# EAGLE design sirvo.v2.6 (EAGLE 6.4)
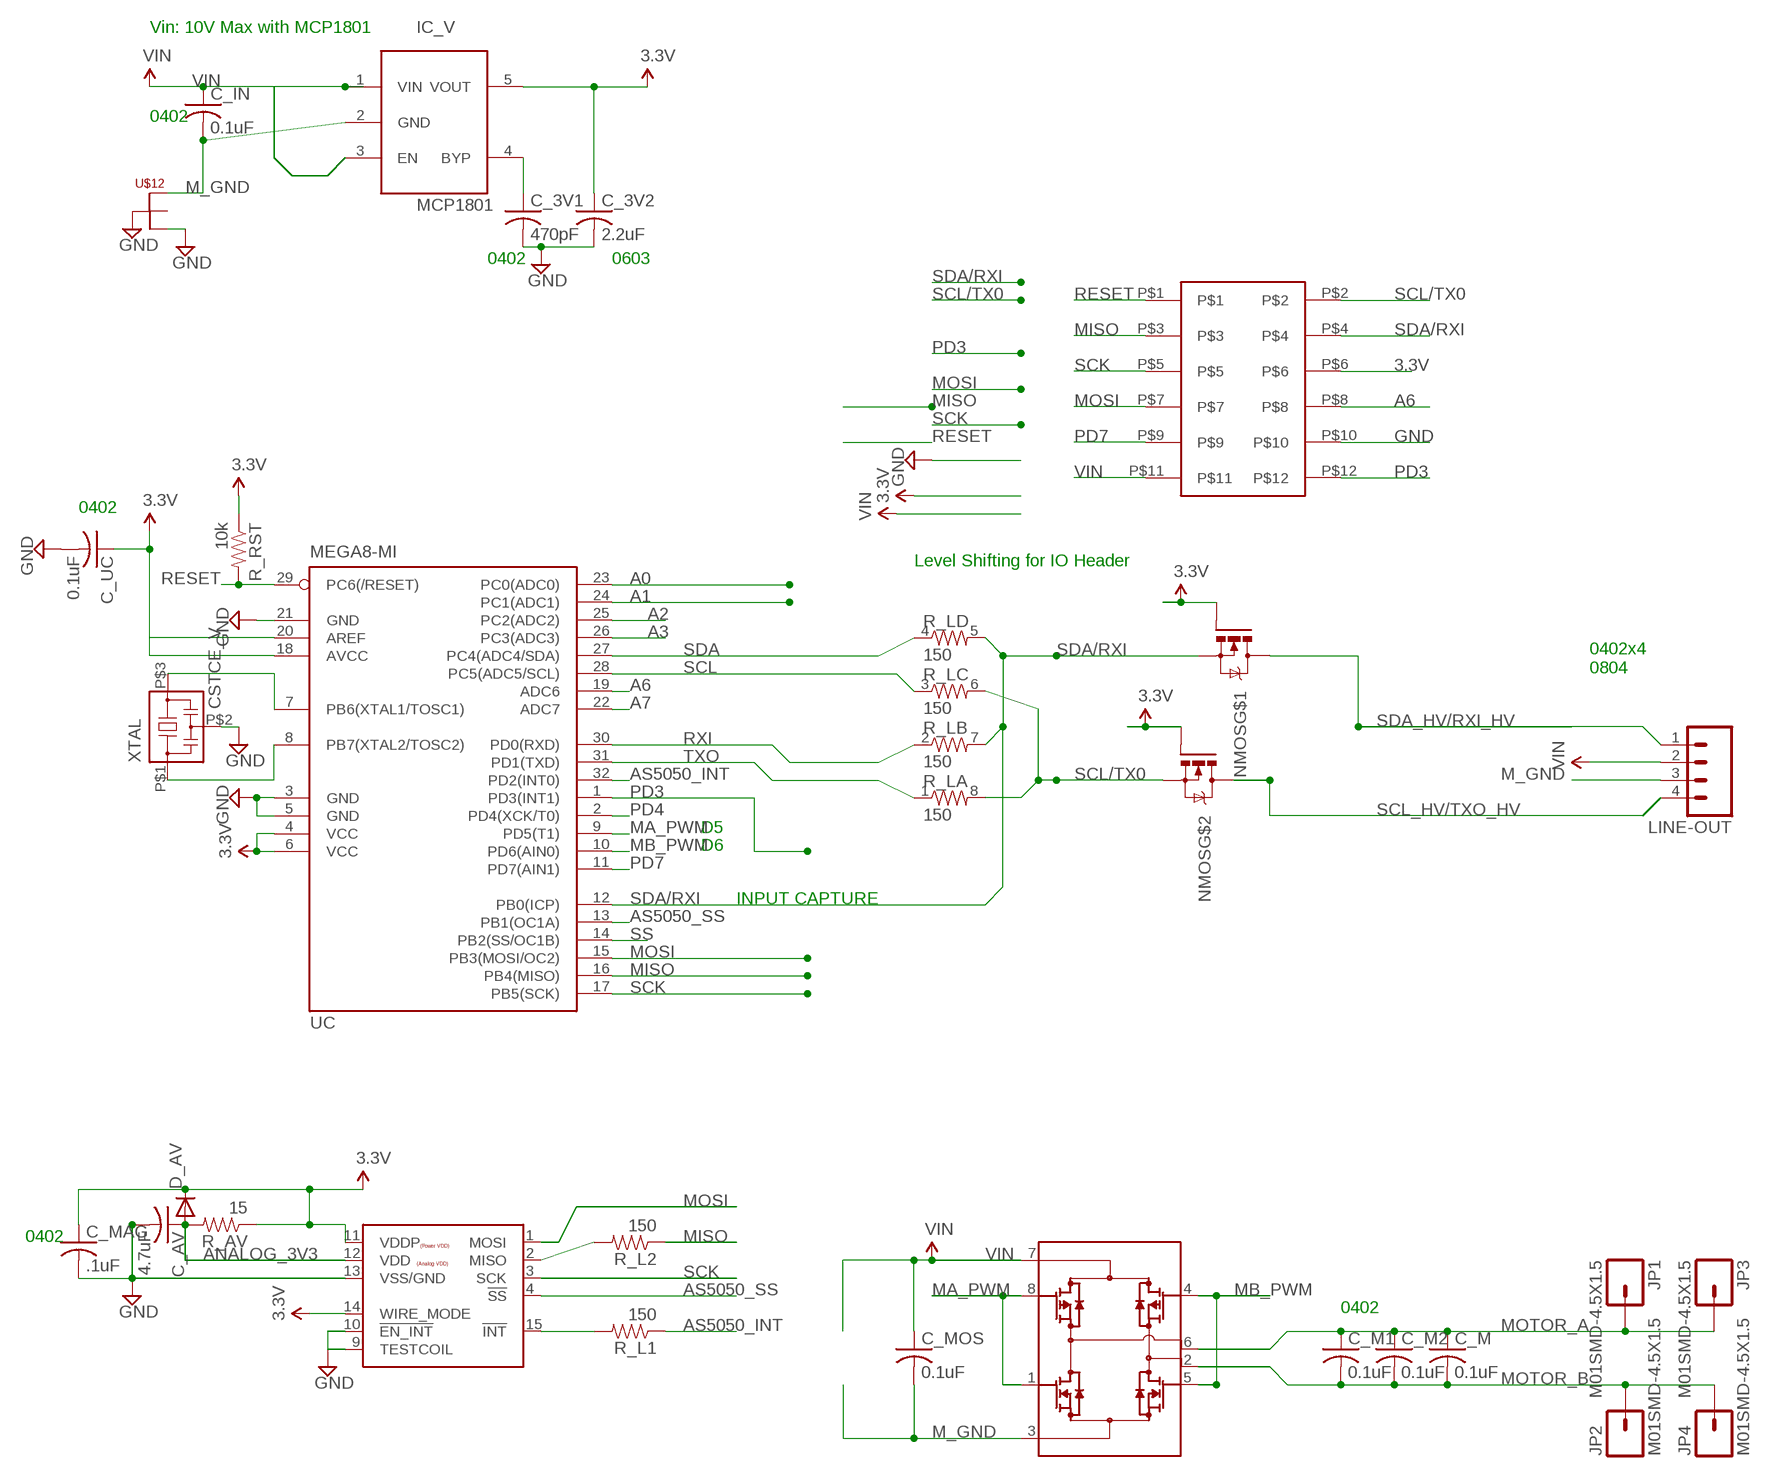
[diagram p0: schematic, sheet 1]

## Parts
<HEADER>  M06X022MM_SMT  [M2X06_SMD]
C_3V1  470pF  C-USC0402  [C0402]
C_3V2  2.2uF  C-USC0603  [C0603]
C_AV  4.7uF  C-USC0603  [C0603]
C_IN  0.1uF  C-USC0402  [C0402]
C_M  0.1uF  C-USC0402  [C0402]
C_M1  0.1uF  C-USC0402  [C0402]
C_M2  0.1uF  C-USC0402  [C0402]
C_MAG  .1uF  C-USC0402  [C0402]
C_MOS  0.1uF  C-USC0402  [C0402]
C_UC  0.1uF  C-USC0402  [C0402]
D_AV  DIODESOD  [SOD-323]
IC_V  MCP1801  LDO-REGULATORMCP1801  [SOT23-5L]
JP1  M01SMD-4.5X1.5  [PAD-1.5X4.5]
JP2  M01SMD-4.5X1.5  [PAD-1.5X4.5]
JP3  M01SMD-4.5X1.5  [PAD-1.5X4.5]
JP4  M01SMD-4.5X1.5  [PAD-1.5X4.5]
LINE-OUT  M041X04_NO_SILK  [1X04_NO_SILK]
MAG  AS5050  [QFN16_4X4]
MOS  MOSFET-ARRAYMOSFET-ARRAY-H-BRIDGE  [SO08]
NMOS  MOSFET-ARRAY-PAIR  [SOT-363]
R_AV  15  RESISTOR0603-RES  [0603-RES]
R_L  150  RESISTOR-ARRAY0603-ARV  [0603-ARV]
R_L1  150  RESISTOR0402-RES  [0402-RES]
R_L2  150  RESISTOR0402-RES  [0402-RES]
R_RST  10k  RESISTOR0603-RES  [0603-RES]
U$12  NET-JUNCTION8-MIL-DIAMETER  [NET-JUNCTION]
UC  MEGA8-MI  [MLF32]
XTAL  CSTCE_V  [CSTCE_V]

## Nets
3.3V: <HEADER>.P$6 C_3V2.1 C_MAG.1 C_UC.1 D_AV.1(C) IC_V.5(VOUT) MAG.11(VDDP) MAG.14(WIRE_MODE) NMOS.P$2(G) NMOS.P$5(G) R_AV.1 R_RST.1 UC.4(VCC) UC.6(VCC) UC.20(AREF)
A0: UC.23(PC0(ADC0))
A1: UC.24(PC1(ADC1))
A2: UC.25(PC2(ADC2))
A3: UC.26(PC3(ADC3))
A6: <HEADER>.P$8 UC.19(ADC6)
A7: UC.22(ADC7)
ANALOG_3V3: C_AV.1 D_AV.2(A) MAG.12(VDD) R_AV.2
AS5050_INT: R_L1.1 UC.32(PD2(INT0))
AS5050_SS: MAG.4(!SS) UC.13(PB1(OC1A))
GND: <HEADER>.P$10 C_3V1.2 C_3V2.2 C_AV.2 C_MAG.2 C_UC.2 MAG.9(TESTCOIL) MAG.10(!EN_INT) MAG.13(VSS/GND) U$12.P$1 U$12.P$4 UC.3(GND) UC.5(GND) UC.21(GND) XTAL.P$2
M_GND: C_IN.2 C_MOS.2 IC_V.2(GND) LINE-OUT.3 MOS.3(N1S/N2S) U$12.P$3
MA_PWM: MOS.1(N1G) MOS.8(P1G) UC.9(PD5(T1))
MB_PWM: MOS.4(N2G) MOS.5(P2G) UC.10(PD6(AIN0))
MISO: <HEADER>.P$3 R_L2.1 UC.16(PB4(MISO))
MOSI: <HEADER>.P$7 MAG.1(MOSI) UC.15(PB3(MOSI/OC2))
MOTOR_A: C_M1.1 C_M2.1 C_M.1 JP1.P$1 JP3.P$1 MOS.6(N2D/P2D)
MOTOR_B: C_M1.2 C_M2.2 C_M.2 JP2.P$1 JP4.P$1 MOS.2(N1D/P1D)
N$1: UC.7(PB6(XTAL1/TOSC1)) XTAL.P$3
N$2: UC.8(PB7(XTAL2/TOSC2)) XTAL.P$1
N$4: C_3V1.1 IC_V.4(BYP)
N$6: MAG.15(!INT) R_L1.2
N$14: MAG.2(MISO) R_L2.2
N$15: UC.18(AVCC)
PD3: <HEADER>.P$12 UC.1(PD3(INT1))
PD4: UC.2(PD4(XCK/T0))
PD7: <HEADER>.P$9 UC.11(PD7(AIN1))
RESET: <HEADER>.P$1 R_RST.2 UC.29(PC6(/RESET))
RXI: R_L.2 UC.30(PD0(RXD))
SCK: <HEADER>.P$5 MAG.3(SCK) UC.17(PB5(SCK))
SCL: R_L.3 UC.28(PC5(ADC5/SCL))
SCL/TX0: <HEADER>.P$2 NMOS.P$1(S) R_L.6 R_L.8
SCL_HV/TXO_HV: LINE-OUT.4 NMOS.P$6(D)
SDA: R_L.4 UC.27(PC4(ADC4/SDA))
SDA/RXI: <HEADER>.P$4 NMOS.P$4(S) R_L.5 R_L.7 UC.12(PB0(ICP))
SDA_HV/RXI_HV: LINE-OUT.1 NMOS.P$3(D)
SS: UC.14(PB2(SS/OC1B))
TXO: R_L.1 UC.31(PD1(TXD))
VIN: <HEADER>.P$11 C_IN.1 C_MOS.1 IC_V.1(VIN) IC_V.3(EN) LINE-OUT.2 MOS.7(P1S/P2S)
Unconnected: U$12.P$5

## Notes on the sheet
- Vin: 10V Max with MCP1801
- 0402
- 0402 | 0603
- 0402
- Level Shifting for IO Header
- 0402x4
  0804
- D5
- D6
- INPUT CAPTURE
- 0402
- 0402

## Library data of the parts
<HEADER> = tekdemo:M06X02
C_3V1 C_3V2 C_AV C_IN C_M C_M1 C_M2 C_MAG C_MOS C_UC = rcl:C-US: CAPACITOR, American symbol
D_AV = tekdemo:DIODE: Diode These are standard reverse protection diodes and small signal diodes. SMA package can handle up to about 1A. SOD-323 can handle about 200mA. What the SOD-323 package when ordering, there are some mfgs out there that are 5-pin packages.
IC_V = tekdemo:LDO-REGULATOR: Standard LDO Footprint
JP1-JP4 = SparkFun-Connectors:M01: Header 1 Standard 1-pin 0.1" header. Use with straight break away headers (SKU : PRT-00116), right angle break away headers (PRT-00553), swiss pins (PRT-00743), machine pins (PRT-00117), and female headers (PRT-00115).
LINE-OUT = SparkFun-Connectors:M04: Header 4 Standard 4-pin 0.1" header. Use with straight break away headers (SKU : PRT-00116), right angle break away headers (PRT-00553), swiss pins (PRT-00743), machine pins (PRT-00117), and female headers (PRT-00115). Molex polarized connector foot print use with SKU : PRT-08231 with associated crimp pins and housings. 1MM SMD Version SKU: PRT-10208
MAG = tekdemo:AS5050
MOS = tekdemo:MOSFET-ARRAY
NMOS = tekdemo:MOSFET-ARRAY-PAIR
R_AV R_L1 R_L2 R_RST = SparkFun-Passives:RESISTOR: Resistor Basic schematic elements and footprints for 0603, 1206, and PTH resistors.
R_L = SparkFun-Passives:RESISTOR-ARRAY: Array Chip Resistor Source: RS Component / Phycomp
U$12 = tekdemo:NET-JUNCTION
UC = atmel:MEGA8: MICROCONTROLLER 8 Kbytes FLASH, 1 kbytes SRAM, 512 bytes EEPROM, USART, 6-channel 10 bit ADC, 2-channel 8 bit ADC Pin compatible with Atmega48, ATMega88, ATMega168 Source: avr.lbr; MPN: ATMEGA88PA-MU; OC_FARNELL: 1715491; OC_NEWARK: 15R0272
XTAL = tekdemo:CSTCE_V

## Board
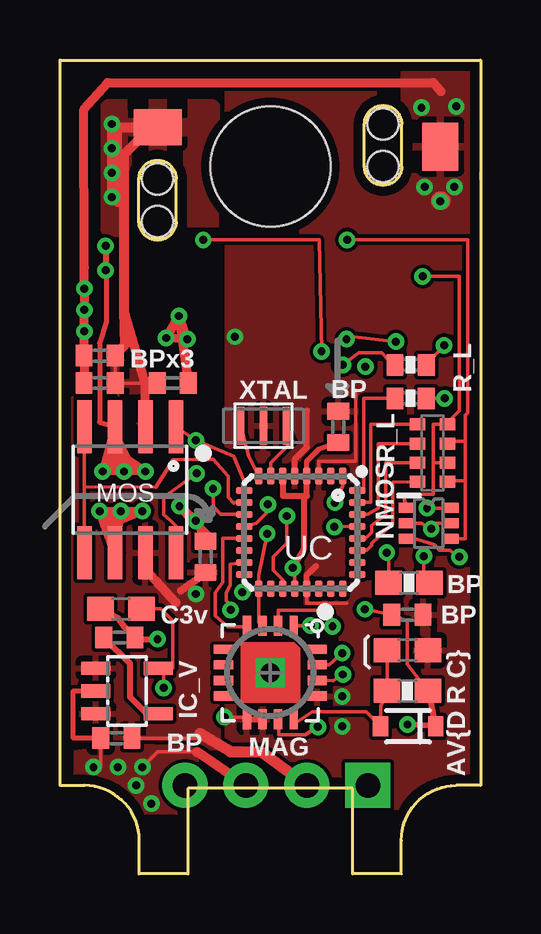
[diagram p1: board, top side]
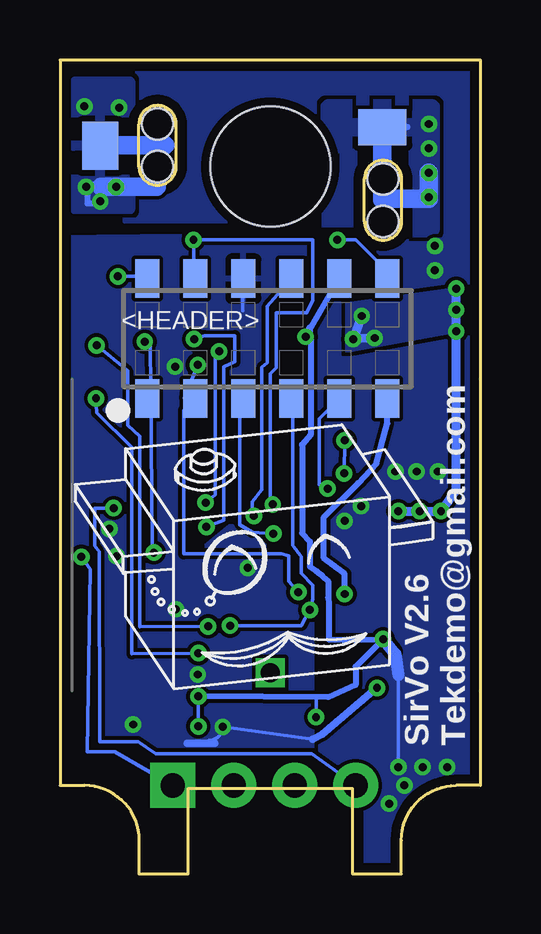
[diagram p2: board, bottom side, seen from below]

Size 17.53 x 33.91 mm. Coordinates in mm from the lower left corner, seen from the top.
Copper layers (1*16): Top 0.0356mm / dielectric 1.5011mm / Bottom 0.0356mm
Design rules "LaenPCBOrder *": minimum track width 6mil, minimum drill 13mil, track to track 6mil, track to pad 6mil, pad to pad 6mil, via to via 6mil, smd to smd 6mil, copper to edge 15mil, drill to drill 6mil, minimum pad ring 7mil, minimum via ring 7mil, stop-mask expansion 4mil, vias tented up to drill 0mil, thermal gap 10mil
tKeepout: area 0,20.3 to 17.5,33.9

### Footprints (pad centres in the part's own frame; a part is rotated, then mirrored left to right if it is on the bottom)
M2X06_SMD = smd 1 x 1.6: P$1 -5,-2.5; P$2 -5,2.5; P$3 -3,-2.5; P$4 -3,2.5; P$5 -1,-2.5; P$6 -1,2.5; P$7 1,-2.5; P$8 1,2.5; P$9 3,-2.5; P$10 3,2.5; P$11 5,-2.5; P$12 5,2.5
C0402 = smd 0.7 x 0.9: 1 -0.65,0; 2 0.65,0
C0603 = smd 1.1 x 1: 1 -0.85,0; 2 0.85,0
SOD-323 = smd 0.63 x 0.83: 1 -1.15,0; 2 1.15,0
SOT23-5L = smd 0.55 x 1.2: 1 -0.95,-1.3; 2 0,-1.3; 3 0.95,-1.3; 4 0.95,1.3; 5 -0.95,1.3
PAD-1.5X4.5 = smd 1.5 x 2: P$1 0,0
1X04_NO_SILK = drill 1.016 pad 1.88 square: 1 0,0 | drill 1.016 pad 1.88: 2 2.54,0; 3 5.08,0; 4 7.62,0
QFN16_4X4 = smd 0.8 x 0.35: 1 -1.95,0.975; 2 -1.95,0.325; 3 -1.95,-0.325; 4 -1.95,-0.975; 9 1.95,-0.975; 10 1.95,-0.325; 11 1.95,0.325; 12 1.95,0.975 | smd 0.35 x 0.8: 5 -0.975,-1.95; 6 -0.325,-1.95; 7 0.325,-1.95; 8 0.975,-1.95; 13 0.975,1.95; 14 0.325,1.95; 15 -0.325,1.95; 16 -0.975,1.95 | drill 0.8 square: P$1 0,0
SO08 = smd 0.61 x 2.21: 1 -1.905,-2.616; 2 -0.635,-2.616; 3 0.635,-2.616; 4 1.905,-2.616; 5 1.905,2.616; 6 0.635,2.616; 7 -0.635,2.616; 8 -1.905,2.616
SOT-363 = smd 0.42 x 0.6: P$1 -0.65,-0.95; P$2 0,-0.95; P$3 0.65,-0.95; P$4 0.65,0.95; P$5 0,0.95; P$6 -0.65,0.95
0603-RES = smd 1.1 x 1: 1 -0.85,0; 2 0.85,0
0603-ARV = smd 0.5 x 0.65: 1 -1.2,-0.625; 2 -0.4,-0.625; 3 0.4,-0.625; 4 1.2,-0.625; 5 1.2,0.625; 6 0.4,0.625; 7 -0.4,0.625; 8 -1.2,0.625
0402-RES = smd 0.7 x 0.9: 1 -0.65,0; 2 0.65,0
SERVO-OUTLINE = hole 5: 8.763,29.464 | hole 1.3: 4.064,27.178; 4.064,28.956; 13.462,29.464; 13.462,31.242
NET-JUNCTION = smd 0.051 x 0.051: P$1 -0.076,0; P$3 0,0.076; P$4 0.076,0; P$5 0,-0.076
MLF32 = smd 0.7 x 0.3: 1 -2.35,1.75; 2 -2.35,1.25; 3 -2.35,0.75; 4 -2.35,0.25; 5 -2.35,-0.25; 6 -2.35,-0.75; 7 -2.35,-1.25; 8 -2.35,-1.75; 17 2.35,-1.75; 18 2.35,-1.25; 19 2.35,-0.75; 20 2.35,-0.25; 21 2.35,0.25; 22 2.35,0.75; 23 2.35,1.25; 24 2.35,1.75 | smd 0.3 x 0.7: 9 -1.75,-2.35; 10 -1.25,-2.35; 11 -0.75,-2.35; 12 -0.25,-2.35; 13 0.25,-2.35; 14 0.75,-2.35; 15 1.25,-2.35; 16 1.75,-2.35; 25 1.75,2.35; 26 1.25,2.35; 27 0.75,2.35; 28 0.25,2.35; 29 -0.25,2.35; 30 -0.75,2.35; 31 -1.25,2.35; 32 -1.75,2.35
CSTCE_V = smd 0.3 x 1.6: P$1 -0.95,0; P$2 0,0; P$3 0.95,0

### Placement (x,y rotation side)
<HEADER>  8.89,22.3 0 bottom
C_3V1  2.48,9.84 0 top
C_3V2  2.54,11.05 180 top
C_AV  14.48,9.32 0 top
C_IN  2.35,5.65 180 top
C_M  1.65,20.45 0 top
C_M1  4.7,20.45 180 top
C_M2  1.65,21.59 0 top
C_MAG  14.48,10.79 0 top
C_MOS  6.07,13.21 90 top
C_UC  11.6,18.62 90 top
D_AV  14.5,6.15 180 top
IC_V  2.79,7.62 270 top
JP1  15.85,30.3 0 top
JP2  4.06,31.11 90 top
JP3  15.85,30.33 0 bottom
JP4  4.09,31.11 270 bottom
LINE-OUT  12.83,3.68 180 top
MAG  8.76,8.38 270 top
MOS  2.92,16 180 top
NMOS  15.37,14.61 270 top
R_AV  14.48,7.62 180 top
R_L  15.52,17.53 270 top
R_L1  14.61,19.81 0 top
R_L2  14.61,21.21 0 top
R_RST  14.54,12.13 180 top
U$1  [LOGO-SIRVO-GOLD]  17.02,7.62 0 bottom
U$3  [SERVO-OUTLINE]  0,0 0 top
U$12  3.63,9.17 270 bottom
UC  10.03,14.22 270 top
XTAL  8.48,18.67 0 top

### Tracks (layer width: path | path; a pad name or v marks a point on that pad's centre or on a via)
3.3V  (via drill 0.33 pad 0.18)
  Top 0.152: v9.7,12.75 9.78,12.47 9.78,11.74 UC.20 | v12.7,11.02 C_MAG.1 14.48,10.53 14.48,8.72 R_AV.1 | v4.32,7.75 4.32,8.57 IC_V.5 4.7,8.57 4.7,10.54 4.19,11.05 C_3V2.1 | 10.29,16.45 UC.4 | NMOS.P$5 15.67,14.61 v15.47,14.38 15.06,14.61 NMOS.P$2 | MAG.11 9.11,5.79 10.21,5.79 v10.74,6.12 | MAG.14 10.98,8.06 11.38,8.05 v11.79,8.31 | R_RST.1 arc-90 15.16,12.61 v15.16,13.23 | 14.43,6.22 v14.48,6.22 | 11.66,18 11.65,18 C_UC.1
  Top 0.203: UC.4 10.28,17.19 10.79,17.7 11.66,18
  Top 0.254: R_AV.1 15.32,7.87 D_AV.1 14.43,6.22 | UC.6 9.28,15.75 10.16,15.75 | 10.16,15.75 10.29,15.75 10.29,16.45 | 10.16,15.75 10.16,13.54 v9.7,12.75
  Bottom 0.152: 6.99,5.61 v10.74,6.12 arc90 11.3,5.56 | <HEADER>.P$6 9.91,24.79 9.91,23.47
  Bottom 0.305: v4.32,7.75 6.6,5.82 6.99,5.61 | 12.22,5.44 11.07,5.44
  other vias: 12.73,21.13
  pour Bottom (rank 2): 6.99,0 6.99,26.67 17.78,26.54 17.53,23.11 17.4,0
A6  (via drill 0.33 pad 0.18)
  Top 0.152: UC.19 9.28,12.26 8.89,12.65 8.89,13.21 9.45,13.77 v9.45,14.91
  Bottom 0.152: v9.45,14.91 9.53,15.04 9.53,15.49 9.12,16 9.12,21.11 8.89,21.29 8.89,23.65 <HEADER>.P$8
ANALOG_3V3
  Top 0.152: C_AV.1 R_AV.2 13.37,6.99 D_AV.2 12.75,6.76 10.52,6.76 9.74,6.22 MAG.12
  Top 0.254: C_AV.1 13.33,9.36
AS5050_INT
  Top 0.152: R_L1.1 12.65,19.81 12.65,15.97 UC.32
AS5050_SS
  Top 0.152: UC.13 6.78,13.97 6.78,12.14 6.48,11.71 6.48,10.74 6.99,10.29 7.79,10.29 MAG.4
GND  (via drill 0.33 pad 0.18)
  Top 0.152: UC.3 10.78,17.2 12.32,17.2 12.32,20.07 | C_3V1.2 arc90 3.19,9.78 | v6.86,6.53 7.79,6.53 MAG.9 | 11.94,11.28 10.28,11.28 UC.21 10.29,11.94
  Top 0.254: MAG.9 MAG.10 | 10.78,16.8 UC.3 | 9.78,17.14 UC.5 9.78,17.28 10.29,17.78 10.29,19.3 | C_3V1.2 2.67,10.29 2.41,10.67 C_3V2.2 | 3.19,9.78 v4.06,9.78 | 10.29,11.94 10.29,12.45 10.67,12.83
  Bottom 0.152: v11.76,7.39 v11.76,6.15 | 6.35,7.37 6.86,7.37 v6.86,6.53
  Bottom 0.254: v11.76,7.39 6.35,7.37 5.21,7.87 5.21,8.64 v4.06,9.78 6.32,9.75 6.32,11.25 6.35,11.51 6.35,12.19 arc-12 7.11,12.8 7.11,13.84 arc-45 7.12,13.85 7.44,14.2 7.44,17.85 arc45 7.44,17.89 7.09,18.29 7.09,22.17 7.14,22.76 v7.29,22.38 <HEADER>.P$10 | U$12.P$4 U$12.P$1
  Bottom 0.508: U$12.P$1 v4.06,9.78
  pour Top: 6.99,2.29 6.99,36.2 17.4,34.16 18.42,1.52
M_GND  (via drill 0.33 pad 0.18)
  Top 0.152: 5.71,5.08 4.06,5.08 v3.43,4.45 | C_IN.2 1.7,4.45 v1.4,4.45
  Top 0.203: C_IN.2 0.56,5.65 0.56,7.62 IC_V.2 | 1.93,25.15 1.93,23.01 1.65,22.12 1.65,18.82 MOS.3
  Top 0.254: v1.91,26.16 v1.91,25.15 1.93,25.15
  Top 0.305: C_MOS.2 v5.66,14.71 | MOS.3 v1.78,16.76 v2.67,16.76 v3.56,16.76
  Top 0.381: v2.67,16.76 2.29,18.29 | v3.56,16.76 2.79,17.27 2.29,18.29 | 2.29,18.29 2.16,16.89 | v5.66,14.71 v4.98,15.32 6.12,14.12
  Top 0.406: LINE-OUT.3 5.71,5.08
  Bottom 0.152: 3.43,8.28 v3.43,4.45
  Bottom 0.508: U$12.P$3 3.43,8.28
  other vias: 2.41,4.45 3.18,3.68 3.81,2.92
  pour Bottom (rank 4): -0.38,0.51 6.99,0 6.99,27.05 -0.38,27.18
  pour Top: 0.64,5.08 2.49,5.36 5.38,5.31 5.71,5.08 5.71,2.54 0.64,2.54
  pour Bottom (rank 6): -1.14,34.04 14.86,33.78 14.86,27.18 6.99,27.18 6.99,24.64 -0.38,24.64 -1.14,25.4
MA_PWM  (via drill 0.33 pad 0.18)
  Top 0.152: MOS.8 4.83,14.5 4.6,14.73 arc45 4.59,14.73 4.32,14.96 4.32,15.7 v5.69,16.69 | UC.9 7.7,16.29 7.24,17.4 v5.66,18.06 MOS.1
  Bottom 0.152: v5.69,16.69 v5.66,18.06
MB_PWM
  Top 0.152: MOS.4 1.02,16.13 | 1.02,16.13 MOS.5 | UC.10 7.26,15.47 7.25,15.45 arc-45 7.24,15.45 7.01,15.7 7.01,16.56 6.38,17.27 5.71,17.27 4.72,17.25 3.99,16.1 1.02,16.13
MISO  (via drill 0.33 pad 0.18)
  Top 0.152: UC.16 v7.6,11.74 | R_L2.1 13.87,21.21 13.41,21.72 12.45,21.72 v11.79,21.21
  Bottom 0.152: v7.6,11.74 8,12.19 8,13.26 8.31,13.34 12.37,13.34 12.37,19.32 <HEADER>.P$3 11.9,19.82 12.34,19.82 v11.79,21.21
MOSI  (via drill 0.33 pad 0.18)
  Top 0.152: UC.15 7.09,12.9 7.09,12.04 6.93,11.68 6.93,11.38 7.11,11.15 arc-45 7.11,11.14 v7.11,11 | MAG.1 v10.44,10.34
  Bottom 0.152: v10.44,10.34 7.47,10.34 v7.11,11 6.99,11.43 6.99,12.01 7.47,12.52 7.47,13.21 7.82,13.69 7.82,19.73 <HEADER>.P$7
MOTOR_A  (via drill 0.33 pad 0.18)
  Top 0.152: MOS.6 2.54,13.39
  Top 0.254: C_M1.1 5.32,20.47 5.32,20.58
  Top 0.381: MOS.6 v1.65,15.11 v2.54,15.11 | v2.54,15.11 v3.43,15.11 1.91,14.48 2.16,14.99 | 2.29,13.46 v2.54,15.11 | v1.02,24.38 1.02,25.27 0.99,31.85 1.98,32.97 15.54,32.97 15.88,32.59 | 1,24.37 v1.02,24.38 | 1.02,21.59 v1.02,22.61 v1.02,23.5 v1.02,24.38 | C_M2.1 1.02,21.59 | 1.02,21.59 1.02,20.45 C_M.1 | v4.95,23.24 5.32,20.58 5.33,20.45 | v4.95,23.24 v5.31,22.28 v4.42,22.33 v4.95,23.24
  Top 0.762: 15.85,28.04 15.88,28.04
  Bottom 0.254: 15.88,30.35 15.88,30.38 | 15.88,28.7 16.38,28.7 16.38,27.94 15.88,27.94
  Bottom 0.381: v3.43,15.11 v1.65,15.11 1.02,16 v1.02,24.38 | v4.42,22.33 v5.31,22.28 v4.95,23.24
  Bottom 0.762: 15.88,30.35 13.49,30.35 | 13.49,30.35 13.13,30.35 | 13.49,30.35 13.49,28.63 15.8,28.63
  other vias: 15.06,31.93 15.19,28.63 15.85,28.02 16.43,28.63 16.51,31.98
  pour Bottom: 1.04,24.38 arc90 1.02,24.36 1.02,22.61 5.59,21.77 5.59,23.75
  pour Bottom (rank 2): 14.61,33.02 14.61,27.69 16.89,27.69 16.89,33.02
  pour Top: 14.35,33.53 14.35,27.18 17.4,27.18 17.4,33.53
MOTOR_B  (via drill 0.33 pad 0.18)
  Top 0.152: C_M1.2 3.56,20.45 C_M.2 C_M2.2
  Top 0.381: 2.67,23.44 3.56,20.45 MOS.2 | 3.81,31.11 JP2.P$1
  Top 0.406: 3.81,31.11 2.67,29.97 2.67,23.44 2.72,22.05 2.29,21.62 | v2.16,31.24 v2.16,30.23 v2.16,29.21 v2.16,28.19 | 2.39,27.99 2.39,31.11 JP2.P$1
  Top 0.457: JP2.P$1 JP4.P$1
  Bottom 0.254: 3.05,31.11 4.06,30.56 JP4.P$1 | v2.16,29.21 2.16,29.23
  Bottom 0.762: v2.16,29.21 v2.16,28.19 | 2.16,28.12 4.09,28.12
  pour Top: 3.56,18.54 3.68,20.45 2.03,21.72 1.65,20.45 2.29,20.45
  pour Bottom (rank 2): 2.08,31.88 2.08,26.9 6.3,26.9 6.3,31.9 2.08,31.9 arc90 2.06,31.88
  pour Top: 2.08,31.88 2.08,26.9 6.3,26.9 6.3,31.9 2.08,31.9 arc90 2.06,31.88
  pour Top: 2.08,31.88 2.08,26.9 6.3,26.9 6.3,31.9 2.08,31.9 arc90 2.06,31.88
N$1
  Top 0.152: UC.7 8.78,17.12 9.68,18.02 XTAL.P$3
N$2
  Top 0.152: UC.8 7.87,17.4 XTAL.P$1
N$3
  pour Bottom: 8.89,14.1 8.89,13.34 11.81,13.34 10.41,14.48
N$4
  Top 0.152: IC_V.4 3.62,6.67
  Top 0.254: 3.62,6.67 2.92,7.37 2.92,8.75 C_3V1.1
N$6  (via drill 0.33 pad 0.18)
  Top 0.152: R_L1.2 v16.03,19.81 | MAG.15 11.22,8.71 v11.76,9.2
  Bottom 0.152: v16.03,19.81 16,19.2 14.53,17.78 14.53,9.17 v11.76,9.2
N$7
  Bottom 0.762: 4.09,28.09 4.09,31.09
N$12
  Top 0.381: 2.29,18.03 2.41,16.89
N$14  (via drill 0.33 pad 0.18)
  Top 0.152: R_L2.2 v16,22.02 | MAG.2 9.09,10.97 11.25,10.97 v11.35,10.31
  Bottom 0.152: v16,22.02 14.71,20.96 14.71,18.69 14.2,18.24 14.2,10.29 v11.35,10.31
PD3  (via drill 0.33 pad 0.18)
  Top 0.152: 11.79,16.59 11.79,16.18 | 11.79,16.18 v11.46,15.47 | v10.9,21.77 10.79,26.42 v5.97,26.42 | UC.1 11.78,16.18 11.79,16.18
  Bottom 0.152: v11.46,15.47 11.05,15.8 11.05,21.59 v10.9,21.77 | v5.97,26.42 5.21,26.42 3.94,25.15 3.94,24.85 <HEADER>.P$12
PD7  (via drill 0.33 pad 0.18)
  Top 0.152: UC.11 arc90 7.67,14.99 6.71,14.99 6.38,15.31 arc-45 6.38,15.32 v6.38,16.05
  Bottom 0.152: v6.38,16.05 6.73,16.2 arc45 6.73,16.21 6.73,18.96 arc45 6.73,18.96 <HEADER>.P$9
RESET  (via drill 0.33 pad 0.18)
  Top 0.152: R_RST.2 13.69,13.23 v13.61,13.39 | v14,22.17 11.89,22.43 v11.94,22.28 | v11.43,14.45 UC.29
  Bottom 0.152: v13.61,13.39 13.69,13.67 13.75,20.07 13.77,22.2 v14,22.17 | v11.94,22.28 11.51,22.43 10.24,22.43 10.24,21.34 10.69,21.13 10.69,14.73 v11.43,14.45
  Bottom 0.254: <HEADER>.P$1 13.89,19.92 13.75,20.07
RXI
  Top 0.152: UC.30 12.82,14.97 12.83,14.99 13.26,15.23 13.26,17.93 R_L.2
SCK  (via drill 0.33 pad 0.18)
  Top 0.152: MAG.3 8.28,10.49 UC.17 8.28,12.45 v8.64,14.17
  Bottom 0.152: v8.64,14.17 9.53,14.22 10.03,14.55 10.03,19.66 <HEADER>.P$5
SCL
  Top 0.152: R_L.3 13.56,17.13 13.56,14.96 12.98,14.53 12.98,14.23 12.72,13.97 UC.28
SCL/TX0  (via drill 0.33 pad 0.18)
  Top 0.152: NMOS.P$1 14.3,15.82 15.54,15.82 15.54,17.13 | 15.54,17.13 15.54,18.73 R_L.8 16.15,18.75 16.15,18.82 16.64,19.3 16.64,24.89 v15.11,24.89 | 15.54,17.13 R_L.6
  Bottom 0.152: v15.11,24.89 13.89,24.89 <HEADER>.P$2
SCL_HV/TXO_HV  (via drill 0.33 pad 0.18)
  Top 0.152: v15.29,15.24 15.95,15.24 NMOS.P$6
  Bottom 0.152: LINE-OUT.4 7.04,5 13.54,5 14.28,5.51 15.88,5.51 15.9,13.41 16.08,13.67 16.08,15.24 v15.29,15.24
SDA
  Top 0.152: UC.27 12.78,13.49 12.98,13.69 12.98,13.77 13.87,14.58 13.87,16.31 R_L.4
SDA/RXI  (via drill 0.33 pad 0.18)
  Top 0.152: 16.89,16.38 16.89,13.97 16.63,13.96 | 16.63,13.96 16.24,13.96 | 16.89,18.03 16.89,16.38 | 16.89,16.38 16.02,16.38 16.02,16.33 R_L.5 | 16.89,18.03 16.89,19.1 16.99,19.2 16.99,26.42 v11.96,26.42 | R_L.7 16.14,18.02 arc-90 16.16,18.03 16.89,18.03 | v8.66,15.39 8.61,15.04 8.18,14.61 7.75,14.48 arc-90 7.74,14.47 UC.12 | NMOS.P$4 arc-90 16.3,13.96 16.63,13.96
  Bottom 0.152: <HEADER>.P$4 11.96,24.8 v11.96,26.42 6.99,26.42 6.99,23.89 7.25,23.37 8.51,23.37 8.51,21.08 8.76,20.83 8.76,15.49 v8.66,15.39
SDA_HV/RXI_HV  (via drill 0.33 pad 0.18)
  Top 0.152: NMOS.P$3 14.86,13.95 15.62,13.72 15.8,13.49 16.23,13.49 v16.64,13.21
  Bottom 0.152: LINE-OUT.1 15.24,5.08 16.38,5.08 16.26,12.7 v16.64,13.21
TXO
  Top 0.152: UC.31 12.95,15.47 12.95,18.73 R_L.1
VIN  (via drill 0.33 pad 0.18)
  Top 0.152: C_IN.1 5.84,5.65 5.84,5.84
  Top 0.305: 6.1,12.55 5.03,11.79
  Top 0.381: 3.56,12.7 4.83,11.3
  Top 0.457: 5.84,5.84 7.11,5.08 8.38,5.08 LINE-OUT.2
  Bottom 0.254: v5.66,11.66 5.66,12.5 6.53,13.16 6.53,14.86 5.11,16.28 4.34,17.09 3.89,18.77 <HEADER>.P$11
  pour Top (rank 3): -1.27,5.21 -1.27,26.67 7.49,26.67 7.49,5.21

### Text on the board
bPlace: SirVo V2.6 / Tekdemo@gmail.com
tNames: BPx3 | BP | R_L | BP | C3v | BP | BP | AV{D R C}
tDocu: 15 | DIODE | C-REG